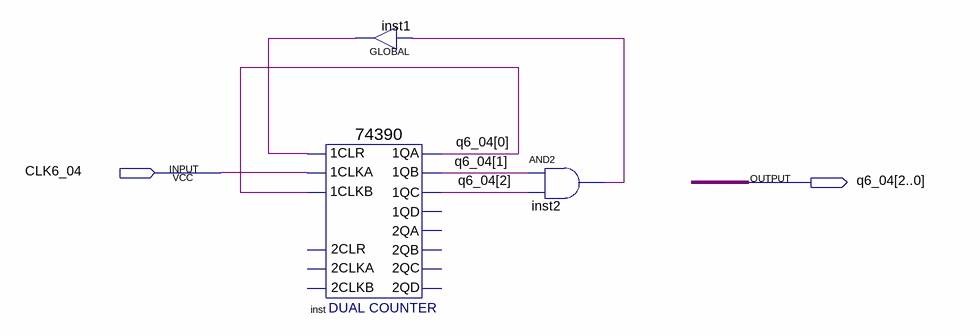
[diagram p0: schematic sheet]
// Quartus schematic counter6_04.bdf as structural Verilog: 3 symbols, 2 pins
module counter6_04 (
  input  CLK6_04,
  output [2:0] q6_04
);

  wire inst1_out, inst2_out;

  \74390  inst (
    .\1CLR (inst1_out), .\1CLKA (CLK6_04), .\1CLKB (q6_04[0]), .\1QA (q6_04[0]), .\1QB (q6_04[1]),
    .\1QC (q6_04[2]));  // open: 2CLKA, 2CLR, 2CLKB, 1QD, 2QA, 2QB, 2QC, 2QD
  GLOBAL inst1 (.IN(inst2_out), .OUT(inst1_out));
  and inst2 (inst2_out, q6_04[1], q6_04[2]);
endmodule
